# EAGLE design untitled (EAGLE 9.6.2)
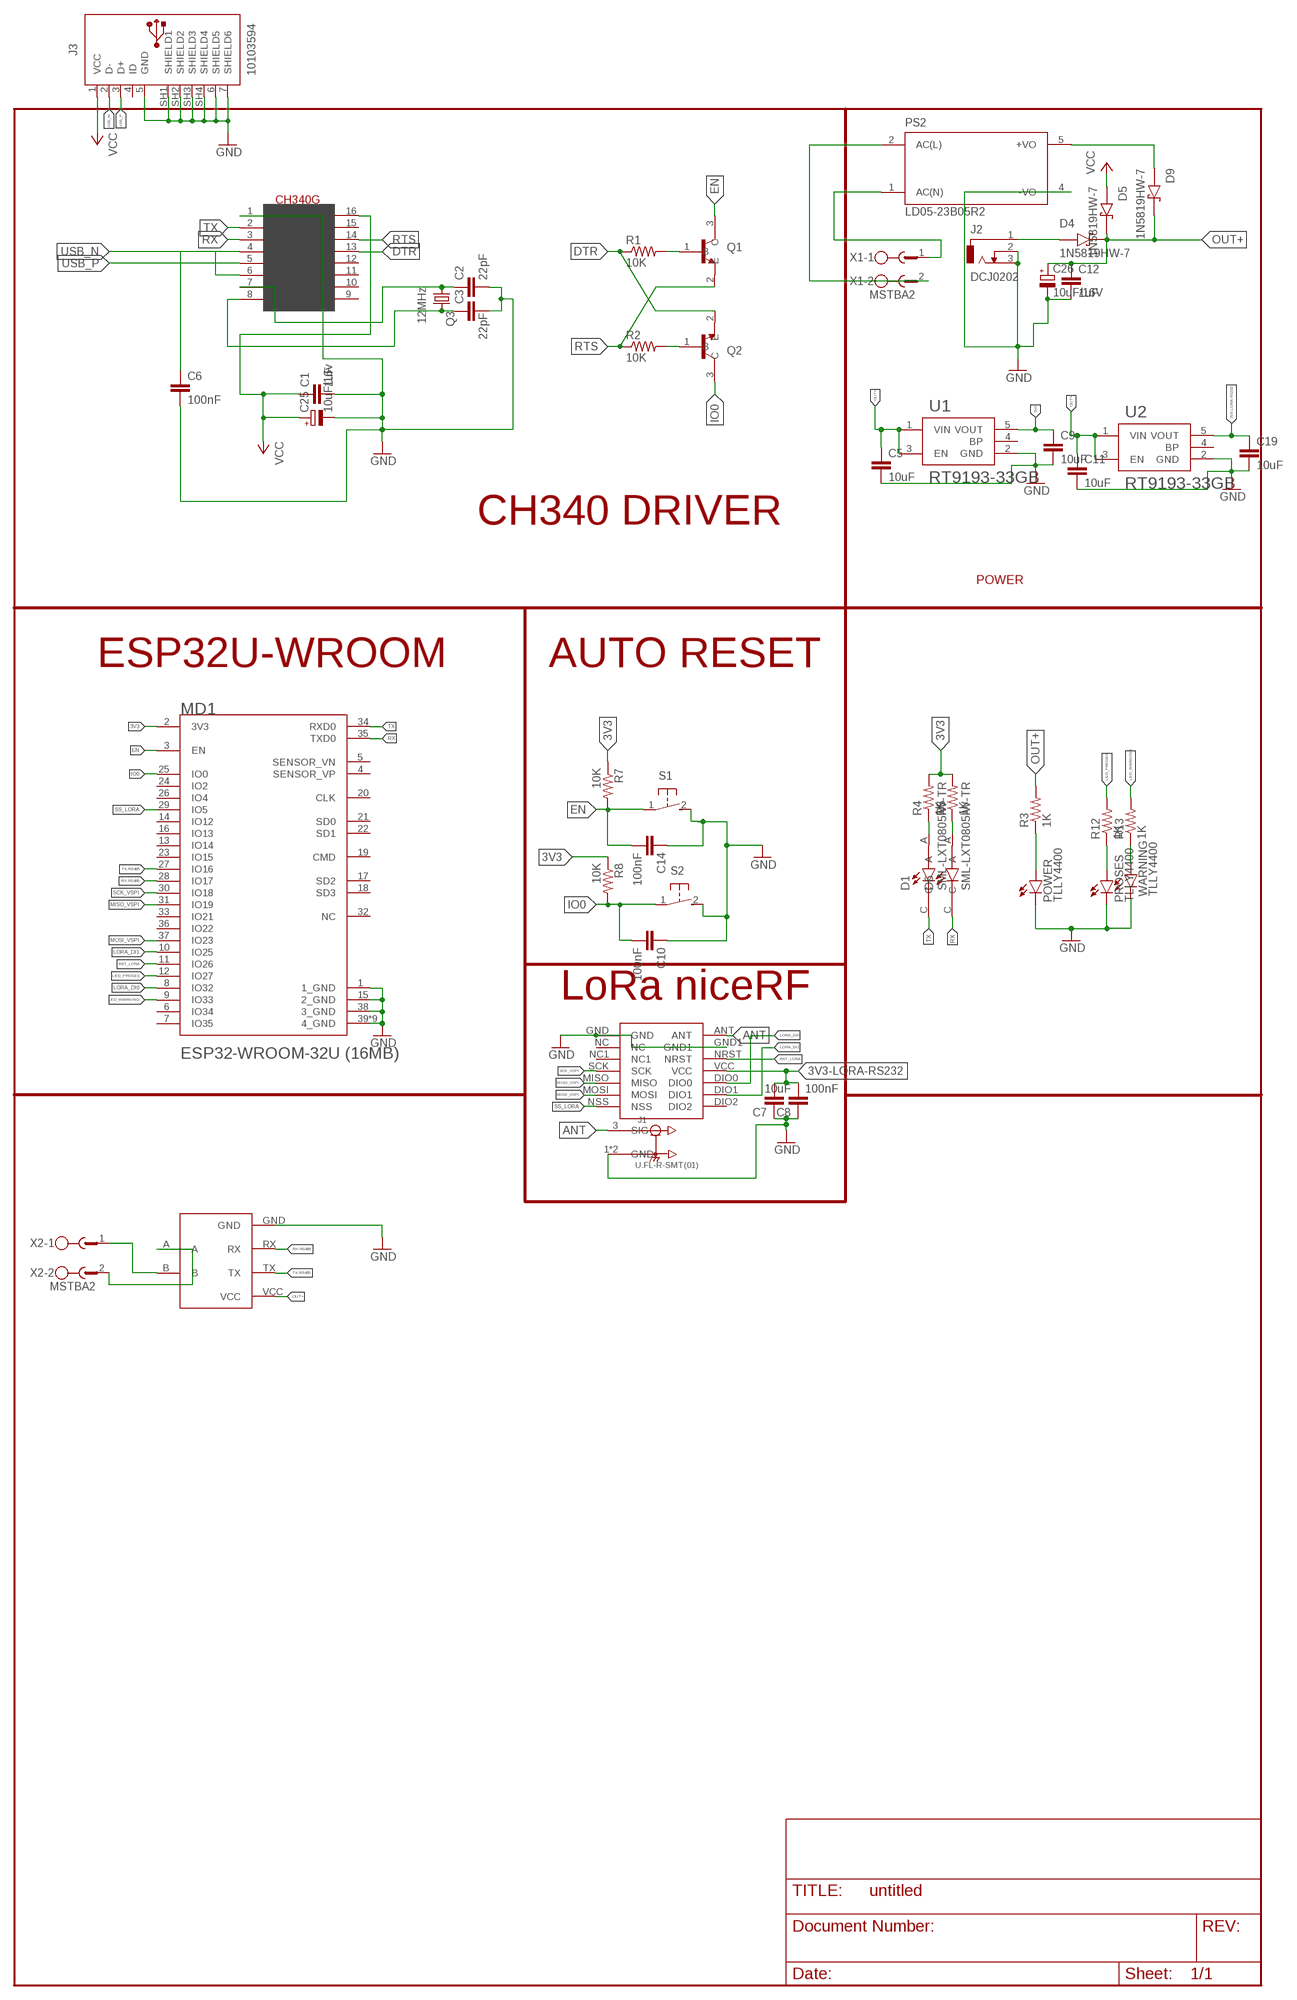
[diagram p0: schematic, sheet 1]

## Parts
C1  1uF  C-EUC0805K  [C0805K]
C2  22pF  C-EUC0805K  [C0805K]
C3  22pF  C-EUC0805K  [C0805K]
C5  10uF  C-EUC0805K  [C0805K]
C6  100nF  C-EUC0805K  [C0805K]
C7  10uF  C-EUC0805K  [C0805K]
C8  100nF  C-EUC0805K  [C0805K]
C9  10uF  C-EUC0805K  [C0805K]
C10  100nF  C-EUC0805K  [C0805K]
C11  10uF  C-EUC0805K  [C0805K]
C12  1uF  C-EUC0805K  [C0805K]
C14  100nF  C-EUC0805K  [C0805K]
C19  10uF  C-EUC0805K  [C0805K]
C25  10uF/16v  CPOL-EU153CLV-0505  [153CLV-0505]
C26  10uF/16V  CPOL-EU153CLV-0505  [153CLV-0505]
D1  SML-LXT0805IW-TR  [LEDC2012X120N]
D4  1N5819HW-7  [SOD3715X145N]
D5  1N5819HW-7  [SOD3715X145N]
D6  SML-LXT0805IW-TR  [LEDC2012X120N]
D9  1N5819HW-7  [SOD3715X145N]
J1  U.FL-R-SMT(01)  [HRS_U.FL-R-SMT(01)]
J2  DCJ0202  [DCJ0202]
J3  10103594  [10103594]
LORA-NICERF-V1  LORA-NICERF-V2  [LORA-NICERF-V2]
MD1  ESPRESSIF_SYSTEMS_ESP32-WROOM-32U_16MBESPRESSIF_SYSTEMS_ESP32-WROOM-32U_16MB_0_0  [ESPRESSIF_SYSTEMS_ESP32-WROOM-32U_16MB_0]
POWER  TLLY4400  [LED3MM]
PROSES  TLLY4400  [LED3MM]
PS2  LD05-23B05R2  [CONV_LD05-23B05R2]
Q1  MMBT3904  [SOT95P240X120-3N]
Q2  MMBT3904  [SOT95P240X120-3N]
Q3  12MHz  CRYSTALSM49  [SM49]
R1  10K  R-US_M0805  [M0805]
R2  10K  R-US_M0805  [M0805]
R3  1K  R-US_M0805  [M0805]
R4  1K  R-US_M0805  [M0805]
R5  1K  R-US_M0805  [M0805]
R7  10K  R-US_M0805  [M0805]
R8  10K  R-US_M0805  [M0805]
R12  1K  R-US_M0805  [M0805]
R13  1K  R-US_M0805  [M0805]
S1  31-XX  [B3F-31XX]
S2  31-XX  [B3F-31XX]
TTL-RS1  TTL-RS485  [TTL-RS485]
U1  RT9193-33GB  [SOT94P279X129-5N]
U2  RT9193-33GB  [SOT94P279X129-5N]
U$2  CH340G  [SOIC16]
WARNING  TLLY4400  [LED3MM]
X1  MSTBA2  [MSTBA2]
X2  MSTBA2  [MSTBA2]

## Nets
3V3: C9.1 MD1.2(3V3) R4.2 R5.2 R7.1 R8.1 U1.5(VOUT)
3V3-LORA-RS232: C7.2 C8.2 C19.1 LORA-NICERF-V1.VCC U2.5(VOUT)
ANT: J1.3(SIG) LORA-NICERF-V1.ANT
DTR: Q2.2(E) R1.1 U$2.13(DTR)
EN: C14.2 MD1.3(EN) Q1.3(C) R7.2 S1.1(P)
GND: C1.2 C2.2 C3.2 C5.2 C6.2 C7.1 C8.1 C9.2 C10.1 C11.2 C12.2 C14.1 C19.2 C25.- C26.- J1.1(GND) J1.2(GND) J2.2 J2.3 J3.5(GND) J3.6(SHIELD5) J3.7(SHIELD6) J3.SH1(SHIELD1) J3.SH2(SHIELD2) J3.SH3(SHIELD3) J3.SH4(SHIELD4) LORA-NICERF-V1.GND LORA-NICERF-V1.GND1 MD1.1(1_GND) MD1.15(2_GND) MD1.38(3_GND) MD1.39(4_GND) MD1.39-2(4_GND) MD1.39-3(4_GND) MD1.39-4(4_GND) MD1.39-5(4_GND) MD1.39-6(4_GND) MD1.39-7(4_GND) MD1.39-8(4_GND) MD1.39-9(4_GND) POWER.K(C) PROSES.K(C) PS2.4(-VO) S1.2(S) S2.2(S) TTL-RS1.GND U1.2(GND) U2.2(GND) U$2.1(GND) WARNING.K(C)
IO0: C10.2 MD1.25(IO0) Q2.3(C) R8.2 S2.1(P)
LED_PROSES: MD1.12(IO27) R12.2
LED_WARNING: MD1.9(IO33) R13.2
LORA_DI0: LORA-NICERF-V1.DIO0 MD1.8(IO32)
LORA_DI1: LORA-NICERF-V1.DIO1 MD1.10(IO25)
MISO_VSPI: LORA-NICERF-V1.MISO MD1.31(IO19)
MOSI_VSPI: LORA-NICERF-V1.MOSI MD1.37(IO23)
N$1: C2.1 Q3.1 U$2.7(XI)
N$2: C3.1 Q3.2 U$2.8(XO)
N$3: POWER.A R3.1
N$4: Q1.1(B) R1.2
N$5: Q2.1(B) R2.2
N$6: D4.A J2.1
N$7: TTL-RS1.B X2.1
N$8: D1.A R4.1
N$9: D6.A R5.1
N$10: TTL-RS1.A X2.2
N$11: PS2.1(AC(N)) X1.1
N$12: C6.1 U$2.4(V3)
N$13: PS2.2(AC(L)) X1.2
N$16: D9.A PS2.5(+VO)
N$25: PROSES.A R12.1
N$28: R13.1 WARNING.A
OUT+: C5.1 C11.1 C12.1 C26.+ D4.C(K) D5.C(K) D9.C(K) R3.2 TTL-RS1.VCC U1.1(VIN) U1.3(EN) U2.1(VIN) U2.3(EN)
RST_LORA: LORA-NICERF-V1.NRST MD1.11(IO26)
RTS: Q1.2(E) R2.1 U$2.14(RTS)
RX: D6.C MD1.35(TXD0) U$2.3(RX)
RX-RS485: MD1.28(IO17) TTL-RS1.RX
SCK_VSPI: LORA-NICERF-V1.SCK MD1.30(IO18)
SS_LORA: LORA-NICERF-V1.NSS MD1.29(IO5)
TX: D1.C MD1.34(RXD0) U$2.2(TX)
TX-RS485: MD1.27(IO16) TTL-RS1.TX
USB_N: J3.2(D-) U$2.6(D-)
USB_P: J3.3(D+) U$2.5(D+)
VCC: C1.1 C25.+ D5.A J3.1(VCC) U$2.16(VCC)
Unconnected: J3.4(ID) LORA-NICERF-V1.DIO2 LORA-NICERF-V1.NC LORA-NICERF-V1.NC1 MD1.4(SENSOR_VP) MD1.5(SENSOR_VN) MD1.6(IO34) MD1.7(IO35) MD1.13(IO14) MD1.14(IO12) MD1.16(IO13) MD1.17(SD2) MD1.18(SD3) MD1.19(CMD) MD1.20(CLK) MD1.21(SD0) MD1.22(SD1) MD1.23(IO15) MD1.24(IO2) MD1.26(IO4) MD1.32(NC) MD1.33(IO21) MD1.36(IO22) U1.4(BP) U2.4(BP) U$2.9(CTS) U$2.10(DSR) U$2.11(RI) U$2.12(DCD) U$2.15(RS232)

## Notes on the sheet
- CH340 DRIVER
- POWER
- ESP32U-WROOM | AUTO RESET
- LoRa niceRF

## Library data of the parts
C1-C3 C5-C12 C14 C19 = rcl:C-EU: CAPACITOR, European symbol; SPICEPREFIX: C
C25 C26 = rcl:CPOL-EU: POLARIZED CAPACITOR, European symbol; SPICEPREFIX: C
D1 D6 = SML-LXT0805IW-TR:SML-LXT0805IW-TR: LED; Luminous Intensity:11µcd; Viewing Angle:140°; Forward Current:30mA; Forward Voltage:2V; Color:Red; LED Color:Red; Leaded Process Compatible:Yes; Lens Color:White; Mounting Type:Surface Mount ;RoHS Compliant: Yes Check availability <https://pricing.snapeda.com/parts/SML-LXT0805IW-TR/Lumex%20Opto/Components/view-part?ref=eda>; AVAILABILITY: In Stock; DESCRIPTION: Red - LED Indication - Discrete 2V 0805 (2012 Metric); MF: Lumex Opto/Components; MP: SML-LXT0805IW-TR; PACKAGE: 0805 Lumex; PRICE: None; PURCHASE-URL: https://pricing.snapeda.com/search/part/SML-LXT0805IW-TR/?ref=eda
D4 D5 D9 = 1N5819HW-7:1N5819HW-7: 1N5819HW Series 40 V 1 A Surface Mount Schottky Barrier Rectifier - SOD-123 Check availability <https://pricing.snapeda.com/parts/1N5819HW-7/Diodes%20Inc./view-part?ref=eda>; AVAILABILITY: In Stock; DESCRIPTION: Diode Schottky 40 V 1A Surface Mount SOD-123; MF: Diodes Inc.; MP: 1N5819HW-7; PACKAGE: SOD-123 Fairchild Semiconductor; PRICE: None; PURCHASE-URL: https://pricing.snapeda.com/search/part/1N5819HW-7/?ref=eda
J1 = U.FL-R-SMT_01_:U.FL-R-SMT(01): U.FL Series 6 Ghz 50 Ohm Ultra-small SMT Coaxial Cable Receptacle Check availability <https://pricing.snapeda.com/parts/U.FL-R-SMT%2801%29/Hirose/view-part?ref=eda>; AVAILABILITY: In Stock; DESCRIPTION: U.FL (UMCC) Connector Receptacle, Male Pin 50Ohm Surface Mount Solder. RF Connectors / Coaxial Connectors; MF: Hirose; MP: U.FL-R-SMT(01); PACKAGE: None; PRICE: None; PURCHASE-URL: https://pricing.snapeda.com/search/part/U.FL-R-SMT(01)/?ref=eda
J2 = con-jack:DCJ0202: DC POWER JACK Source: DCJ0202.pdf; OC_FARNELL: unknown; OC_NEWARK: unknown
J3 = Connector_USB:10103594: USB(2.0) Micro-B, RCPT, 5POS, SMD-THT-R/A Datasheet <https://cdn.amphenol-icc.com/media/wysiwyg/files/documentation/datasheet/inputoutput/io_usb_micro.pdf> Drawing <https://cdn.amphenol-icc.com/media/wysiwyg/files/drawing/10103594.pdf>; CATEGORY: Connectors; CONTACTS: 5; CURRENT-RATING: 1.8A; DESCRIPTION: CONN RCPT USB2.0 MICRO B SMD R/A; GENDER: Receptacle; MANUFACTURER: Amphenol ICC (FCI); MOUNT_TYPE: R/A; MPN: 10103594-0001LF; OPERATING_TEMPERATURE: -30°C ~ 80°C; PART_STATUS: ACTIVE; ROHS_COMPLIANT: COMPLIANT; SUB_CATEGORY: USB; TYPE: USB-micro B; VOLTAGE-RATING: 100VAC
LORA-NICERF-V1 = LORA-NICERF-V2:LORA-NICERF-V2
MD1 = Espressif Systems - ESP32-WROOM-32U (16MB):ESPRESSIF_SYSTEMS_ESP32-WROOM-32U_16MB: Bluetooth, WiFi 802.11b/g/n, Bluetooth v4.2 +EDR, Class 1, 2 and 3 Transceiver Module 2.4GHz ~ 2.5GHz Antenna Not Included, U.FL Surface Mount; AUTOMOTIVE: No; BANDWIDTH: 72MHz; CENTROID_NOT_SPECIFIED: No; DATASHEET: https://www.espressif.com/sites/default/files/documentation/esp32-wroom-32d_esp32-wroom-32u_datasheet_en.pdf; DATA_RATE: 150Mbits/s; DEVICE_CLASS_L1: Integrated Circuits (ICs); DEVICE_CLASS_L2: RF Semiconductors and Devices; DEVICE_CLASS_L3: Transceivers; DIGIKEY_DESCRIPTION: RX TXRX MODULE WIFI U.FL SMD; DIGIKEY_PART_NUMBER: 1904-1028-1-ND; FOOTPRINT_VARIANT_NAME_0: Recommended_Land_Pattern; HEIGHT: 3.35mm; INTERFACE: I2C,SPI,UART,Ethernet,I2S,Other; LEAD_FREE: Yes; MAX_FREQUENCY: 2484MHz; MAX_SUPPLY_VOLTAGE: 3.6V; MF: Espressif Systems; MFG_PACKAGE_IDENT: 0; MFG_PACKAGE_IDENT_DATE: 0; MFG_PACKAGE_IDENT_REV: 0; MIN_SUPPLY_VOLTAGE: 3V; MOUSER_PART_NUMBER: 356-ES32WROOM32U16MB; MPN: ESP32-WROOM-32U (16MB); NOMINAL_SUPPLY_CURRENT: 0.5A; NUMBER_OF_ADC_CHANNELS: 16; NUMBER_OF_GPIO: 26; PACKAGE: BT_MODULE; PREFIX: MD; ROHS: Yes; SENSITIVITY: -98dBm; TEMPERATURE_RANGE_HIGH: +85°C; TEMPERATURE_RANGE_LOW: -40°C; VERIFICATION_VERSION: 0.0.0.3
POWER PROSES WARNING = led:TLLY4400: Low Current (2mA) LED 3 mm Tinted Diffused Package color YELLOW Source: Data sheet <http://www.farnell.com/datasheets/391098.pdf>; MF: VISHAY SEMICONDUCTOR; OC_FARNELL: 1612439
PS2 = LD05-23B05R2:LD05-23B05R2: AC/DC Converter Check availability <https://pricing.snapeda.com/parts/LD05-23B05R2/Mornsun%20America%2C%20LLC/view-part?ref=eda>; AVAILABILITY: In Stock; DESCRIPTION: Enclosed AC DC Converters 1 Uitgang 5V - - - 1A 85 ~ 305 VAC, 100 ~ 430 VDC Input; MF: Mornsun America, LLC; MP: LD05-23B05R2; PACKAGE: CUSTOM-4 MORNSUN; PRICE: None; PURCHASE-URL: https://pricing.snapeda.com/search/part/LD05-23B05R2/?ref=eda
Q1 Q2 = MMBT3904:MMBT3904: MMBT3904 Series 40 V CE Breakdown 0.2 A NPN General Purpose Amplifier - SOT-23 Check availability <https://pricing.snapeda.com/parts/MMBT3904/STMicroelectronics/view-part?ref=eda>; AVAILABILITY: Not in stock; DESCRIPTION: SMD Transistor MMBT3904 SOT-23 SMD DIOTEC; MF: STMicroelectronics; MP: MMBT3904; PACKAGE: SOT-23 ON; PRICE: None
Q3 = adafruit:CRYSTAL: CRYSTAL; OC_FARNELL: unknown; OC_NEWARK: unknown
R1-R5 R7 R8 R12 R13 = adafruit:R-US_: RESISTOR, American symbol
S1 S2 = switch-omron:31-XX: OMRON SWITCH; MPN: B3F-3100; OC_FARNELL: 959704; OC_NEWARK: 36M3582
TTL-RS1 = TTL-RS485:TTL-RS485
U1 U2 = RT9193-33GB:RT9193-33GB: RT9193 Series 300 mA 3.3 V Ultra-Low Noise Ultra-Fast CMOS LDO Regulator-SC-70-5 Check availability <https://pricing.snapeda.com/parts/RT9193-33GB/Richtek%20USA%20Inc./view-part?ref=eda>; AVAILABILITY: In Stock; DESCRIPTION: Linear Voltage Regulator IC Positive Fixed 1 Output 300mA SOT-23-5; MF: Richtek USA Inc.; MP: RT9193-33GB; PACKAGE: SOT-23-5 Richtek; PRICE: None; PURCHASE-URL: https://pricing.snapeda.com/search/part/RT9193-33GB/?ref=eda
U$2 = usb-serial:CH340G
X1 X2 = con-phoenix-508:MSTBA2: PHOENIX; MF: FARNELL; MPN: 1757242; OC_FARNELL: 3705171; OC_NEWARK: 71C4161

## Net classes
0 default: width 0.2 mm, clearance 0.15 mm

## Board
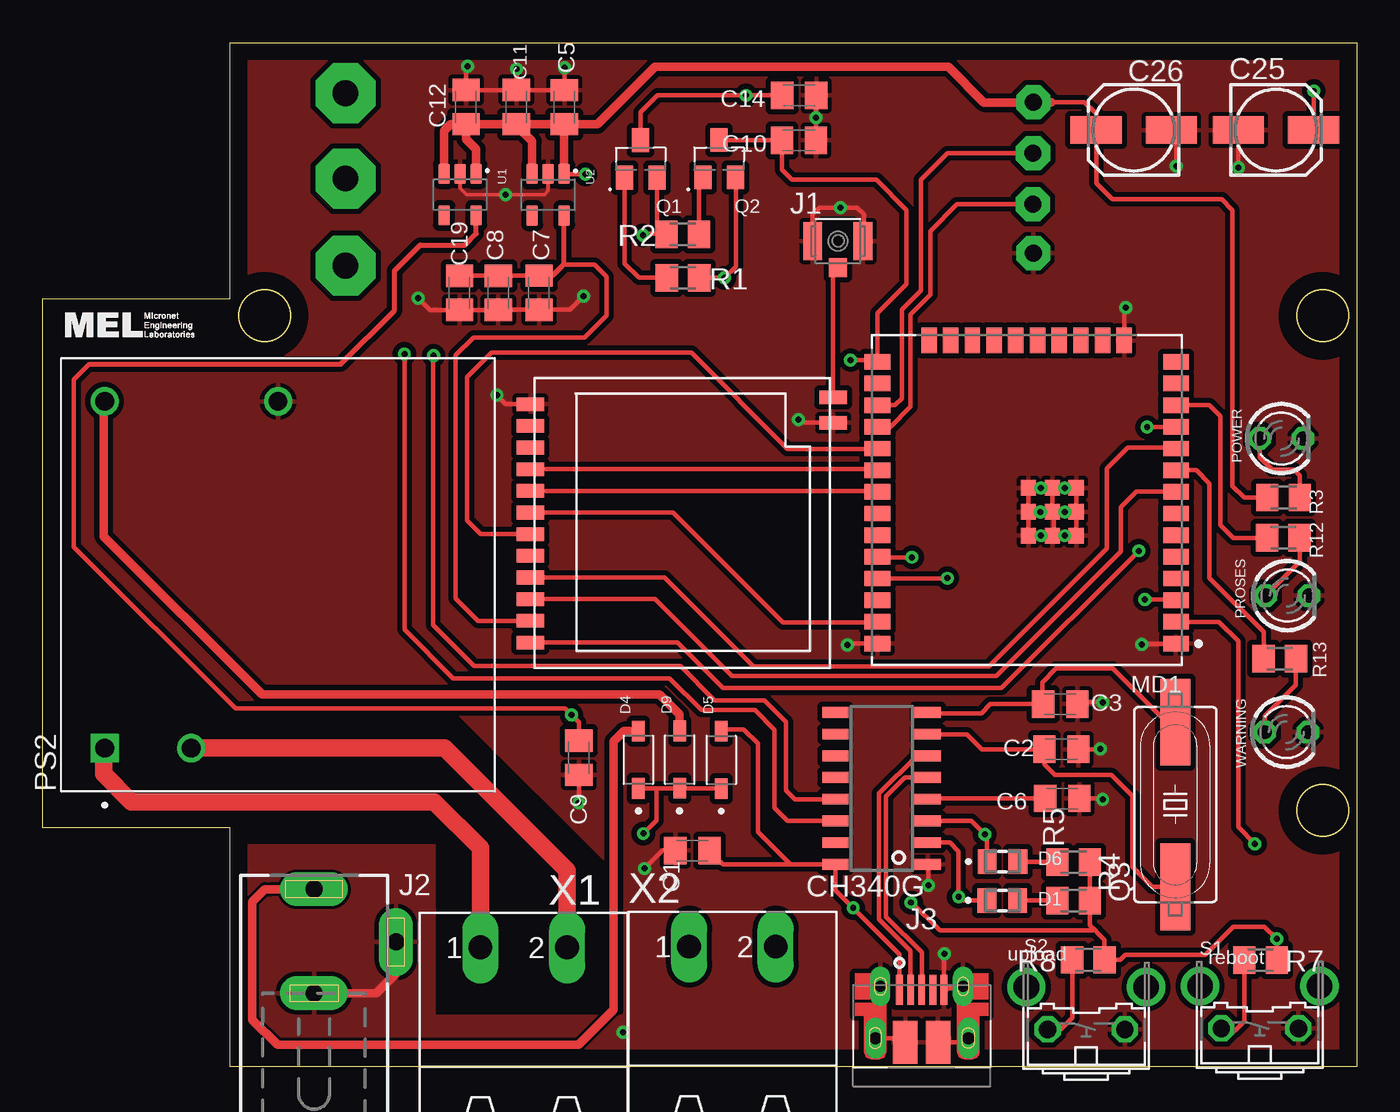
[diagram p1: board, top side]
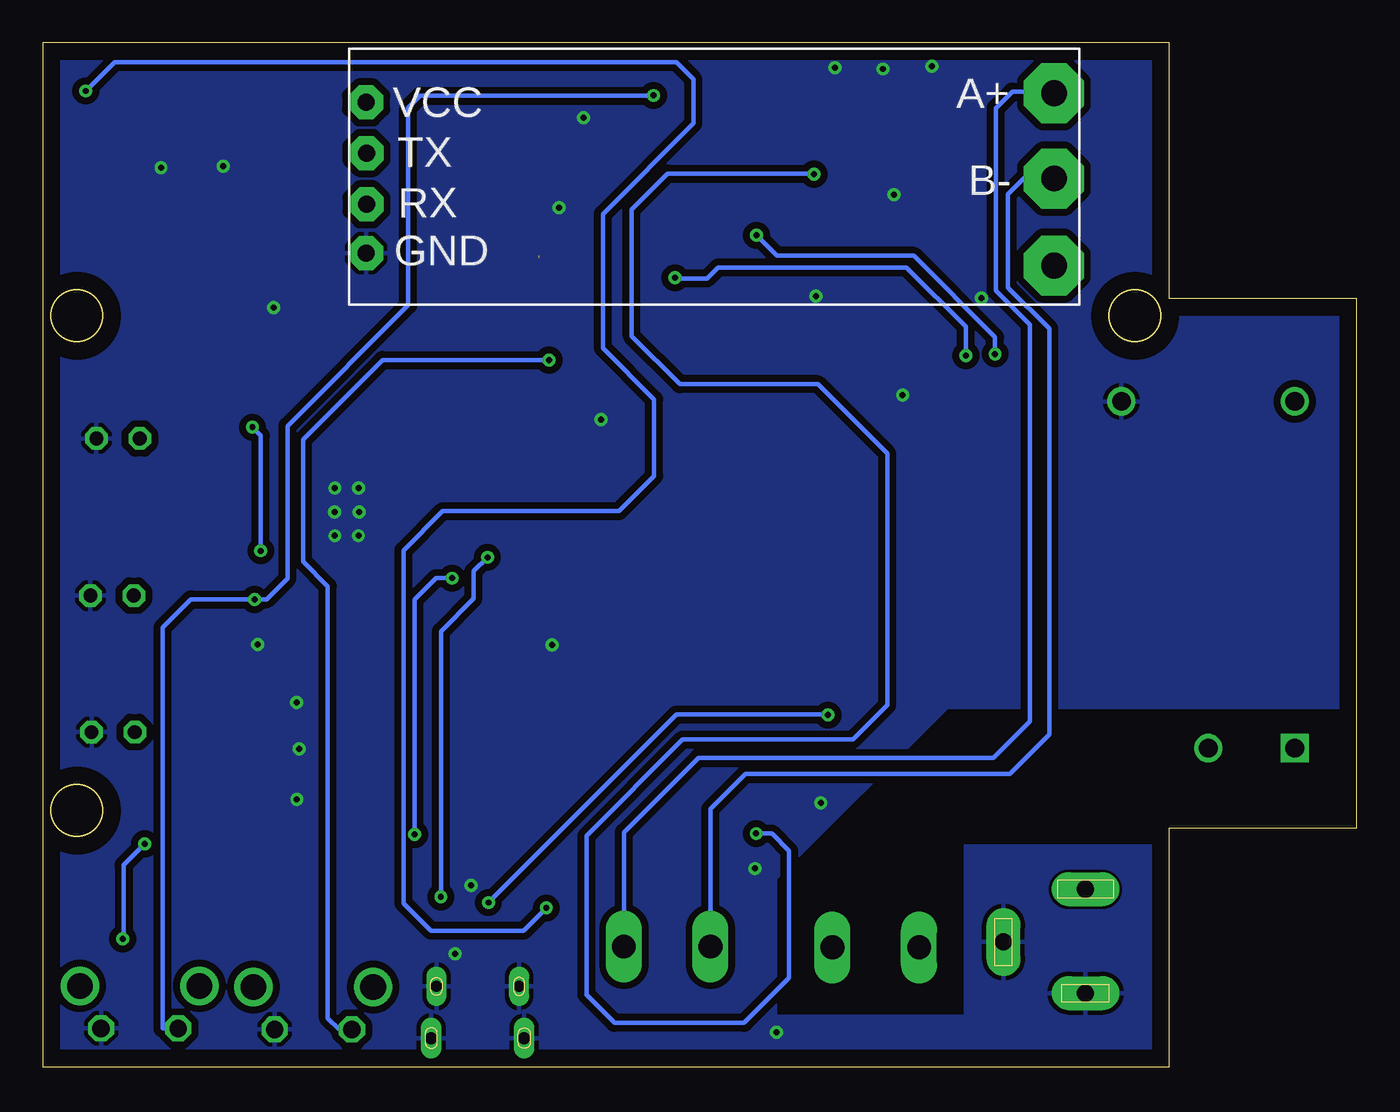
[diagram p2: board, bottom side, seen from below]

Size 77 x 60 mm. Coordinates in mm from the lower left corner, seen from the top.
Outline: 11,60 77,60 77,0 11,0 11,14 0,14 0,45 11,45 11,60
Outline: circle at 75,44 radius 1.5
Outline: circle at 13,44 radius 1.5
Outline: circle at 75,15 radius 1.5
Copper layers (1*16): Top 0.035mm / dielectric 1.5mm / Bottom 0.035mm
Design rules "default *": minimum track width 6mil, minimum drill 0.3mm, track to track 6mil, track to pad 6mil, pad to pad 6mil, via to via 6mil, smd to smd 6mil, copper to edge 40mil, drill to drill 6mil, minimum pad ring 10mil, minimum via ring 8mil, stop-mask expansion 4mil, vias tented up to drill 0mil, thermal gap 10mil

### Footprints (pad centres in the part's own frame; a part is rotated, then mirrored left to right if it is on the bottom)
C0805K = smd 1.3 x 1.6: 1 -1,0; 2 1,0
153CLV-0505 = smd 3 x 1.6: + 2.2,0; - -2.2,0
LEDC2012X120N = smd 1.1 x 1.45: A 0.9,0; C -0.9,0
SOD3715X145N = smd 1.21 x 0.73: A 1.68,0; C -1.68,0
HRS_U.FL-R-SMT(01) = smd 1.1 x 2.25: 1 -1.475,0; 2 1.475,0 | smd 1.05 x 1.1: 3 0,-1.55
DCJ0202 = drill 1 pad 2 long: 1 0,3.1; 2 4.8,0; 3 0,-3
10103594 = smd 0.4 x 1.75: 1 -1.3,2.825; 2 -0.65,2.825; 3 0,2.825; 4 0.65,2.825; 5 1.3,2.825 | smd 1.425 x 2.5: 6 -0.963,-0.25; 7 0.963,-0.25 | drill 0.65 pad 0.73 long: SH1 -2.425,3.03; SH2 2.425,3.03 | drill 0.7 long: SH3 -2.725,0; SH4 2.725,0
LORA-NICERF-V2 = smd 1.6 x 0.8: ANT 9.17,6.81; DIO0 -8.57,-5.03; DIO1 -8.57,-3.76; DIO2 -8.57,-2.49; GND -8.57,6.4; GND1 9.17,5.31; MISO -8.57,1.32; MOSI -8.57,0.05; NC -8.57,5.13; NC1 -8.57,3.86; NRST -8.57,-7.57; NSS -8.57,-1.22; SCK -8.57,2.59; VCC -8.57,-6.3
ESPRESSIF_SYSTEMS_ESP32-WROOM-32U_16MB_0 = smd 1.5 x 0.9: 1 -8.75,8.41; 2 -8.75,7.14; 3 -8.75,5.87; 4 -8.75,4.6; 5 -8.75,3.33; 6 -8.75,2.06; 7 -8.75,0.79; 8 -8.75,-0.48; 9 -8.75,-1.75; 10 -8.75,-3.02; 11 -8.75,-4.29; 12 -8.75,-5.56; 13 -8.75,-6.83; 14 -8.75,-8.1; 25 8.75,-8.1; 26 8.75,-6.83; 27 8.75,-5.56; 28 8.75,-4.29; 29 8.75,-3.02; 30 8.75,-1.75; 31 8.75,-0.48; 32 8.75,0.79; 33 8.75,2.06; 34 8.75,3.33; 35 8.75,4.6; 36 8.75,5.87; 37 8.75,7.14; 38 8.75,8.41 | smd 0.9 x 1.5: 15 -5.71,-9.35; 16 -4.44,-9.35; 17 -3.17,-9.35; 18 -1.9,-9.35; 19 -0.63,-9.35; 20 0.64,-9.35; 21 1.91,-9.35; 22 3.18,-9.35; 23 4.45,-9.35; 24 5.72,-9.35 | smd 0.9 x 0.9: 39 -2.9,2.09; 39-2 -1.5,0.69; 39-3 -1.5,2.09; 39-4 -0.1,2.09; 39-5 -0.1,-0.71; 39-6 -1.5,-0.71; 39-7 -2.9,-0.71; 39-8 -0.1,0.69; 39-9 -2.9,0.69
LED3MM = drill 0.813 octagon: A -1.27,0; K 1.27,0
CONV_LD05-23B05R2 = drill 1.1 square: 1 -10.16,10.16 | drill 1.1: 2 -10.16,5.08; 4 10.16,0; 5 10.16,10.16
SOT95P240X120-3N = smd 1 x 1.4: 1 -0.95,-1.1; 2 0.95,-1.1; 3 0,1.1
SM49 = smd 5.08 x 1.778: 1 -4.826,0; 2 4.826,0
M0805 = smd 1.3 x 1.6: 1 -0.95,0; 2 0.95,0
B3F-31XX = drill 1.016 octagon: 1 -2.261,-1.245; 2 2.261,-1.245 | drill 1.499 pad 2.159: 3 -3.505,1.245; 4 3.505,1.245
TTL-RS485 = drill 1.5 pad 3.5 octagon: A -19.7,-6; B -19.7,-1; P$7 -19.7,4.1 | drill 1 pad 2 octagon: GND 20.6,3.37; RX 20.581,0.505; TX 20.583,-2.493; VCC 20.6,-5.47
SOT94P279X129-5N = smd 1.17 x 0.67: 1 -1.22,0.94; 2 -1.22,0; 3 -1.22,-0.94; 4 1.22,-0.94; 5 1.22,0.94
SOIC16 = smd 0.635 x 1.524: 1 -4.445,-2.695; 2 -3.175,-2.695; 3 -1.905,-2.695; 4 -0.635,-2.695; 5 0.635,-2.695; 6 1.905,-2.695; 7 3.175,-2.695; 8 4.445,-2.695; 9 4.445,2.695; 10 3.175,2.695; 11 1.905,2.695; 12 0.635,2.695; 13 -0.635,2.695; 14 -1.905,2.695; 15 -3.175,2.695; 16 -4.445,2.695
MSTBA2 = drill 1.397 long: 1 -2.54,5.08; 2 2.54,5.08

### Placement (x,y rotation side)
C1  38.07,12.66 180 top
C2  59.69,18.59 0 top
C3  59.62,21.24 0 top
C5  30.57,56.22 90 top
C6  59.74,15.71 0 top
C7  29.08,45.35 90 top
C8  26.69,45.34 90 top
C9  31.42,18.1 270 top
C10  44.31,54.28 180 top
C11  27.75,56.22 90 top
C12  24.81,56.23 90 top
C14  44.33,56.91 180 top
C19  24.42,45.34 270 top
C25  72.26,54.88 0 top
C26  63.93,54.88 180 top
D1  56.23,9.73 0 top
D4  34.9,17.98 90 top
D5  39.76,17.97 90 top
D6  56.23,12.01 0 top
D9  37.32,17.99 90 top
J1  46.59,48.37 0 top
J2  15.9,7.3 0 top
J3  51.51,1.67 0 top
LORA-NICERF-V1  37.15,32.42 0 top
MD1  57.66,33.2 180 top
POWER  72.58,36.81 0 top
PROSES  72.93,27.6 0 top
PS2  13.79,28.82 90 top
Q1  35.04,53.19 0 top
Q2  39.63,53.2 0 top
Q3  66.37,15.35 90 top
R1  37.52,46.22 180 top
R2  37.5,48.76 0 top
R3  72.7,33.34 180 top
R4  60.41,9.73 0 top
R5  60.41,11.97 0 top
R7  71.36,6.25 180 top
R8  61.27,6.25 180 top
R12  72.69,30.98 180 top
R13  72.49,23.89 180 top
S1  71.32,3.48 0 top
S2  61.14,3.42 0 top
TTL-RS1  37.45,51.04 180 bottom
U1  24.46,51.1 270 top
U2  29.62,51.08 270 top
U$2  49.16,16.3 90 top
WARNING  72.87,19.6 0 top
X1  28.18,1.9 0 top
X2  40.41,1.96 0 top

### Tracks (layer width: path | path; a pad name or v marks a point on that pad's centre or on a via)
3V3  (via drill 0.35)
  Top 0.254: R7.1 v72.31,7.48 71.59,8.2 69.76,8.2 68.12,6.56 63.45,6.56 63.14,6.25 R8.1 62.22,7.43 61.82,7.82 61.67,7.98 | C9.1 31.42,20.17 v30.99,20.6 30.61,20.98 11.3,20.98 1.83,30.45 1.83,40.25 2.73,41.15 | MD1.2 68.92,26.06 70.05,24.94 70.05,14.03 v71.03,13.05 | 61.67,7.98 52.56,7.98 50.9,9.63 v50.88,9.61 | R4.2 | R5.2 61.36,10 R4.2 | R4.2 | 61.67,7.98 61.36,8.29 R4.2
  Top 0.305: 2.73,41.15 17.46,41.15 20.61,44.3 20.61,46.64 22.12,48.15 24.75,48.15 25.4,48.8 U1.5
  Bottom 0.254: v71.03,13.05 72.26,11.82 72.26,7.53 v72.31,7.48 | v50.88,9.61 39.86,20.63 31.02,20.63 v30.99,20.6
3V3-LORA-RS232
  Top 0.254: C7.2 C8.2 C19.1 | C19.1 | 28.53,26.07 LORA-NICERF-V1.VCC 25.5,26.12 24.2,27.42 24.2,41.69 25.24,42.73 31.76,42.73 33.03,44 33.03,46.3 32.35,46.98 30.5,46.98 30.43,46.91
  Top 0.305: C7.2 29.87,46.35 30.43,46.91 30.56,47.04 U2.5
ANT
  Top 0.254: LORA-NICERF-V1.ANT 46.31,46.54 J1.3
DTR  (via drill 0.35)
  Top 0.254: R1.1 v39.95,46.22 40.61,46.88 40.61,52.08 Q2.2 | U$2.13 44.08,15.67 43.55,16.2 43.55,20.2 42.29,21.46 39.38,21.46 37.36,23.48 25.27,23.48 22.87,25.88 22.87,41.66 v22.9,41.66
  Bottom 0.254: v22.9,41.66 22.9,43.35 26.38,46.83 37.42,46.83 38.08,46.17 39.85,46.17 39.94,46.26 39.95,46.24 v39.95,46.22
EN  (via drill 0.35)
  Top 0.254: R7.2 70.41,2.65 69.85,2.09 69.2,2.09 S1.1 | Q1.3 35.04,55.92 36.03,56.91 v41.21,56.91 C14.2 | v64.59,27.38 66.36,27.38 MD1.3
  Bottom 0.254: S1.1 69.98,2.24 69.98,25.72 68.32,27.38 v64.59,27.38 63.88,27.38 62.65,28.6 62.65,37.54 55.58,44.62 55.58,56.2 54.87,56.9 v41.21,56.9 v41.21,56.91
GND  (via drill 0.35)
  Top 0.203: U2.2 29.58,52.26 29.62,52.23 29.62,51.33 29.4,51.11 v27.11,51.11 24.83,51.11 24.46,51.47 U1.2
  Top 0.254: C3.2 60.74,21.36 62.11,21.36 v62.11,21.35 | C2.2 61.95,18.59 v61.96,18.6 | C6.2 62.06,15.71 v62.11,15.66 | C26.- 66.43,54.58 v66.43,52.76 | C25.- v70.06,52.68 v70.07,52.67 | LORA-NICERF-V1.GND 27.13,38.82 v26.61,39.34 | C11.2 C5.2 30.59,57.24 v30.59,58.53 | C11.2 C12.2 24.81,58.54 v24.89,58.62 | C11.2 27.75,58.43 v27.78,58.46 | C19.2 C8.1 C7.1 30.89,44.35 v31.69,45.15 | C19.2 | C19.2 22.69,44.34 v22,45.03 | 45.31,56.89 C14.1 | J1.1 45.12,49.96 45.5,50.34 v46.74,50.34 47.72,50.34 48.12,49.95 48.12,48.42 J1.2 | C9.2 v31.42,15.45 v31.41,15.45 | C1.2 36.31,12.66 v35.25,11.6 | LORA-NICERF-V1.GND1 44.46,37.73 v44.27,37.92 | 59.24,31.11 MD1.39-3 v58.5,31.11 MD1.39-4 MD1.39-8 | 59.24,31.11 v59.88,31.11 MD1.39 MD1.39-9 | MD1.39-9 v59.89,32.51 MD1.39-2 | MD1.39-2 59.24,32.43 59.24,31.11 | MD1.39-8 v58.46,32.51 MD1.39-2 | MD1.39-8 MD1.39-5 v58.49,33.91 MD1.39-6 | MD1.39-6 v59.88,33.91 MD1.39-7 MD1.39-9 | MD1.39-6 MD1.39-2 | MD1.15 63.37,44.39 v63.45,44.47 | U$2.1 51.89,11.83 v51.89,10.61 | J3.7 53.98,1.42 J3.SH4 54.23,4.4 J3.SH2 53.82,4.59 52.81,4.59 | J3.SH3 48.85,1.67 | 48.85,1.67 50.29,1.67 J3.6 | J3.SH1 48.85,4.47 48.85,1.67 | J3.5 52.81,4.59 | 52.81,4.59 52.81,6.58 v52.85,6.62 | MD1.1 66.39,24.77 64.4,24.77 v64.4,24.75 | C10.1 v45.31,55.6 45.31,56.89 | 45.31,56.89 | MD1.38 47.22,24.79 v47.15,24.72
  Top 0.508: J2.3 19.54,4.3 20.77,5.53 20.77,7.23 J2.2
  other vias: 34,2
  pour Top (isolate 0.305): 11,60 77,60 77,0 34,0 34,3 34,11 24,21 0,21 0,45 11,45
  pour Bottom (isolate 0.406): 11,60 77,60 77,0 34,0 34,11 24,21 0,21 0,45 11,45
  pour Bottom: 11,13 23,13 23,3 34,3 34,0 11,0
  pour Top: 11,13 23,13 23,3 34,3 34,0 11,0
IO0  (via drill 0.35)
  Top 0.254: R8.2 60.32,2.86 59.62,2.16 58.89,2.16 S2.1 | 40.1,54.34 39.81,54.34 | 39.81,54.34 39.67,54.34 Q2.3 | 39.81,54.34 39.87,54.28 C10.2 43.31,52.56 43.92,51.96 48.85,51.96 50.61,50.19 50.61,45.86 48.91,44.16 MD1.25 48.8,41.4 v47.34,41.4
  Bottom 0.254: S2.1 59.63,2.17 60.3,2.84 60.3,28.15 61.75,29.59 61.75,36.74 57.08,41.4 v47.34,41.4
LED_PROSES
  Top 0.254: R12.2 69.77,30.98 69,31.75 69,38.11 68.35,38.76 MD1.12
LED_WARNING
  Top 0.254: R13.2 71.54,25.47 68.37,28.63 68.37,34.18 67.6,34.95 MD1.9
LORA_DI0
  Top 0.254: LORA-NICERF-V1.DIO0 35.89,27.39 40.39,22.89 55.87,22.89 63.17,30.19 63.17,32.79 64.09,33.71 66.38,33.71 MD1.8
LORA_DI1
  Top 0.254: LORA-NICERF-V1.DIO1 36.42,28.66 41.64,23.44 55.44,23.44 62.35,30.36 62.35,35.05 63.58,36.28 66.35,36.28 MD1.10
MISO_VSPI
  Top 0.254: LORA-NICERF-V1.MISO 48.85,33.74 MD1.31
MOSI_VSPI
  Top 0.254: LORA-NICERF-V1.MOSI 36.93,32.47 43.38,26.01 48.86,26.01 MD1.37
N$1
  Top 0.254: U$2.7 54.15,19.48 55.04,18.59 C2.1 58.69,17.71 59.31,17.09 62.62,17.09 63.85,15.85 63.85,11.71 65.03,10.53 Q3.1
N$2
  Top 0.254: C3.1 58.56,21.24 | 58.56,21.24 55.54,21.24 55,20.7 51.9,20.7 U$2.8 | Q3.2 65.86,20.18 62.72,23.32 59.37,23.32 58.56,22.51 58.56,21.24
N$3
  Top 0.254: R3.1 73.65,34.63 73.31,34.97 72.03,34.97 71.31,35.7 POWER.A
N$4
  Top 0.254: R1.2 34.93,46.22 34.09,47.06 Q1.1
N$5
  Top 0.254: R2.2 38.45,51.87 Q2.1
N$6
  Top 0.508: D4.A 34.06,19.66 33.45,19.05 33.45,3.32 31.4,1.27 13.76,1.27 12.27,2.76 12.27,9.65 13.02,10.4 13.43,10.4 J2.1
N$7
  Bottom 0.254: X2.1 37.87,15.09 35.82,17.14 20.34,17.14 18.02,19.46 18.02,43.25 20.43,45.66 20.43,51.13 19.51,52.05 TTL-RS1.B
N$8
  Top 0.254: D1.A R4.1
N$9
  Top 0.254: 57.17,11.98 D6.A 59.43,12.01 R5.1
N$10
  Bottom 0.254: X2.2 42.95,13.73 38.58,18.1 21.29,18.1 19.17,20.22 19.17,43.47 21.16,45.46 21.16,56.16 20.19,57.13 17.84,57.13 TTL-RS1.A
N$11
  Top 1.016: X1.1 25.64,12.8 22.93,15.52 5.2,15.52 3.58,17.15 3.58,18.61 PS2.1
N$12
  Top 0.254: C6.1 51.9,15.71 U$2.4
N$13
  Top 1.016: X1.2 30.73,11.5 23.55,18.67 8.72,18.67 PS2.2
N$16
  Top 0.508: D9.A 37.32,20.62 36.14,21.81 12.86,21.81 3.59,31.07 3.59,38.95 PS2.5
N$25
  Top 0.254: PROSES.A 73.64,29.58 R12.1
N$28
  Top 0.254: WARNING.A 71.6,20.54 73.44,22.38 R13.1
OUT+  (via drill 0.35)
  Top 0.254: 34.89,16.29 D4.C 35.97,16.3 | D5.C 39.72,16.33 39.7,16.31 D9.C 37.31,16.3 35.97,16.3 | TTL-RS1.VCC 58.06,56.52 59.09,56.52 61.05,56.52 61.73,55.84 C26.+ 61.73,51.76 62.67,50.81 69.08,50.81 69.71,50.18 69.71,34.03 70.39,33.34 R3.2 | 35.97,16.3 35.97,14.43 v35.19,13.65 | v31.81,52.29 30.58,52.29 U2.1
  Top 0.508: C5.1 C11.1 27.68,55.22 | 27.68,55.22 C12.1 | C12.1 24.81,54.35 25.4,53.76 U1.1 | 30.31,54.97 30.43,55.08 | 30.43,55.08 C5.1 | U1.3 23.52,54.86 23.89,55.22 C12.1 | U2.3 28.68,54.22 27.68,55.22 | U2.1 30.56,54.95 30.43,55.08 | C5.1 32.51,55.22 35.87,58.58 53.08,58.58 55.16,56.49 59.06,56.49 59.09,56.52
  Bottom 0.254: v35.19,13.65 34.28,13.65 33.26,12.64 33.26,5.2 35.9,2.56 43.5,2.56 45.14,4.21 45.14,13.52 39.5,19.16 29.54,19.16 27.51,21.19 27.51,35.91 31.59,39.99 39.66,39.99 42.48,42.81 42.48,50.22 40.38,52.32 31.85,52.32 v31.81,52.29
RST_LORA  (via drill 0.35)
  Top 0.254: LORA-NICERF-V1.NRST 37.2,24.85 39.86,22.19 56.18,22.19 v64.22,30.23 | v64.71,37.47 64.73,37.49 MD1.11
  Bottom 0.254: v64.22,30.23 64.22,36.97 v64.71,37.47
RTS  (via drill 0.35)
  Top 0.254: R2.1 36.51,48.8 | 36.51,48.8 35.99,49.32 Q1.2 | U$2.14 43.65,14.4 42.89,15.16 42.89,19.74 41.74,20.89 38.59,20.89 36.72,22.76 24.06,22.76 21.19,25.62 v21.19,41.76 | v35.18,48.71 35.27,48.8 36.51,48.8
  Bottom 0.254: v21.19,41.76 21.19,42.75 25.96,47.52 33.98,47.52 v35.18,48.71
RX  (via drill 0.35)
  Top 0.254: D6.C 55.33,13.48 v55.2,13.61 54.41,14.4 U$2.3 | v53.01,28.62 52.99,28.6 MD1.35
  Bottom 0.254: v55.2,13.61 55.2,27.37 53.95,28.62 v53.01,28.62
RX-RS485
  Top 0.254: MD1.28 49.66,37.49 50.85,38.68 50.85,44.08 52,45.23 52,48.96 53.58,50.53 TTL-RS1.RX
SCK_VSPI
  Top 0.254: LORA-NICERF-V1.SCK 48.85,35.01 MD1.30
SS_LORA
  Top 0.254: LORA-NICERF-V1.NSS 25.67,31.2 24.88,31.99 24.88,40.41 26.3,41.83 38,41.83 43.65,36.19 48.88,36.19 MD1.29
TX  (via drill 0.35)
  Top 0.254: D1.C 53.89,9.73 v53.67,9.95 53.67,12.62 53.15,13.13 U$2.2 | v50.94,29.84 48.93,29.84 MD1.34
  Bottom 0.254: v53.67,9.95 53.67,25.51 51.76,27.42 51.76,29.03 v50.94,29.84
TX-RS485
  Top 0.254: MD1.27 49.95,38.76 50.34,39.15 50.34,44.35 51.45,45.46 51.45,51.97 53,53.53 TTL-RS1.TX
USB_N
  Top 0.254: J3.2 50.86,6.77 49.01,8.62 49.01,16.01 51.21,18.21 U$2.6
USB_P
  Top 0.254: J3.3 51.51,6.7 49.42,8.79 49.42,15.84 50.52,16.94 U$2.5
VCC  (via drill 0.35)
  Top 0.254: C1.1 39.87,11.86 43.81,11.86 | 43.81,11.86 U$2.16 | U$2.16 | 43.81,11.86 41.9,13.76 41.9,18.93 41.07,19.76 39.88,19.76 D5.A | J3.1 50.21,6.58 v47.49,9.29 46.45,10.33 U$2.16 | v74.47,57.17 74.47,54.87 74.56,54.78
  Top 0.406: 74.56,54.78 C25.+
  Bottom 0.254: v47.48,9.29 | v47.48,9.29 v47.49,9.29 48.82,7.96 54.25,7.96 55.85,9.57 55.85,30.25 53.56,32.55 43.24,32.55 41.17,34.61 41.17,39.1 44.18,42.11 44.18,49.96 38.87,55.27 38.87,57.85 39.88,58.86 72.79,58.86 v74.47,57.17

### Text on the board
tNames: upload | reboot